# Altium schematic sheet phantom_power.SchDoc
size A4
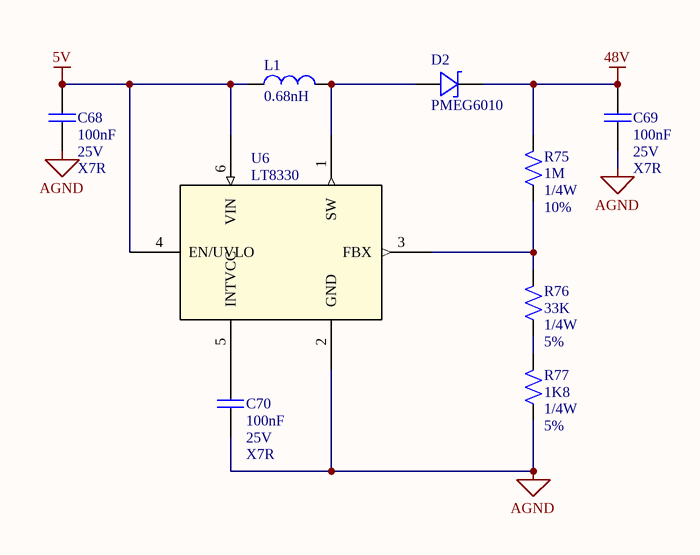
[diagram p0: phantom_power.SchDoc]

## Parts
C68  valor: 100nF  tension: 25V  tolerancia: X7R  [C0805]  (hidden comment: Capacitor)
C69  valor: 100nF  tension: 25V  tolerancia: X7R  [C0805]  (hidden comment: Capacitor)
C70  valor: 100nF  tension: 25V  tolerancia: X7R  [C0805]  (hidden comment: Capacitor)
D2  PMEG6010  [SOD128]
L1  0.68nH  [L0805]
R75  Valor: 1M  Potencia: 1/4W  Tolerancia: 10%  [R0805]  (hidden comment: Resistor)
R76  Valor: 33K  Potencia: 1/4W  Tolerancia: 5%  [R0805]  (hidden comment: Resistor)
R77  Valor: 1K8  Potencia: 1/4W  Tolerancia: 5%  [R0805]  (hidden comment: Resistor)
U6  LT8330  [S6]

## Nets
5V: C68.1 L1.1 U6.4(EN/UVLO) U6.6(VIN)
48V: C69.1 D2.1 R75.2
AGND: C68.2 C69.2 C70.2 R77.1 U6.2(GND)
NetC70_1: C70.1 U6.5(INTVCC)
NetD2_2: D2.2 L1.2 U6.1(SW)
NetR75_1: R75.1 R76.2 U6.3(FBX)
NetR76_1: R76.1 R77.2

## Library data of the parts
C68-C70 = Capacitor: Capacitor de placas paralelas; Encapsulado: 0805
D2 = Schottky Diode: Cod. Proveedor: 1727-5845-1-ND; Encapsulado: SOD-128; Proveedor: Digi-Key; Fabricante: Nexperia; Link: https://www.digikey.com/product-detail/es/PMEG6010EP,115/1727-5845-1-ND/2697507?utm_campaign=buynow&WT.z_cid=ref_octopart_dkc_buynow&utm_medium=aggregator&curr=usd&site=us&utm_source=octopart
L1 = Inductor: Encapsulado: SMD; Proveedor: Digi-Key; Cod. Proveedor: 478-7137-1-ND; Fabricante: AVX Corporation; Valor: 0.68nH; Link: https://www.digikey.com/product-detail/es/L0201R68AHSTR/500/478-7137-1-ND/3455469?utm_campaign=buynow&WT.z_cid=ref_octopart_dkc_buynow&utm_medium=aggregator&curr=usd&site=us&utm_source=octopart
R75-R77 = Resistor: Resistencia
U6 = LT8330: Low IQ Boost/SEPIC/Inverting Converter with 1A, 60V Switch; Fabricante: Linear Technology/Analog Devices; Cod. Proveedor: LT8330ES6#TRMPBFCT-ND; Encapsulado: TSOT-23-6; Proveedor: Digi-Key; Link: https://www.digikey.com/product-detail/es/LT8330ES6%2523TRMPBF/LT8330ES6%2523TRMPBFCT-ND/5361671?utm_campaign=buynow&WT.z_cid=ref_octopart_dkc_buynow&utm_medium=aggregator&curr=usd&site=us&utm_source=octopart